# Altium schematic sheet mikroBUS Connection.SchDoc
size A3; Company Name: Renesas Electronics America; CompanyURL: www.renesas.com; PageSetup: Record=PageOptions|CenterHorizontal=True|CenterVertical=True|PrintScale=1.00|XCorrection=1.00|YCorrection=1.00|PrintKind=1|BorderSize=5000000|LeftOffset=0|BottomOffset=0|Orientation=2|PaperLength=1000|PaperWidth=1000|Scale=100|PaperSource=7|PrintQuality=-4|MediaType=1|DitherType=10|PaperKind=A5 148x210mm|PrintScaleMode=1; ReleaseDate: 16.09.2025; Version: MP; SheetNumber: 6; SheetTotal: 18; VariantNumber: 0; DSheetNumber: 1
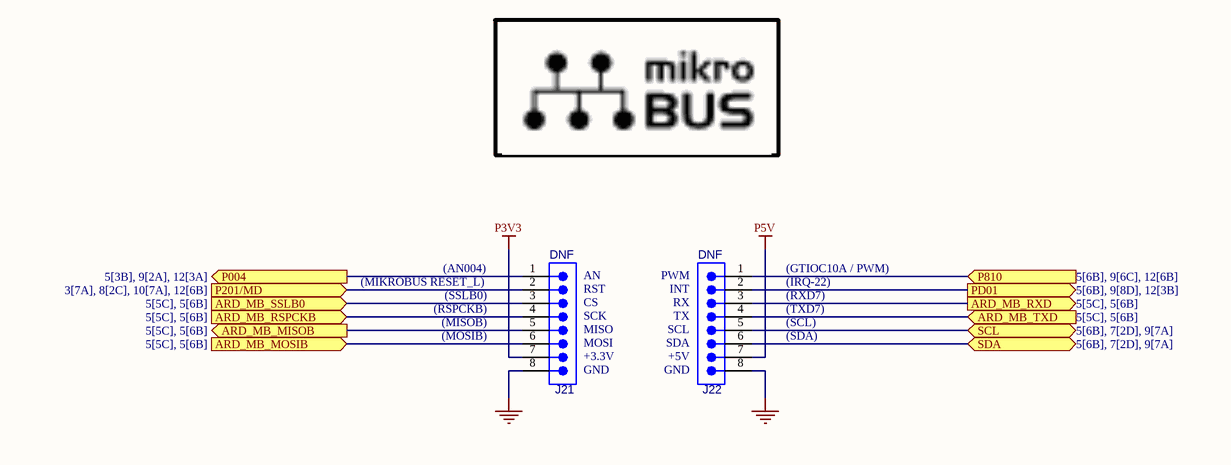
[diagram p0: mikroBUS Connection.SchDoc]

## Parts
J21  CES-108-01-T-S  [sam_CES-108-01-T-S]  (value not drawn)
J22  CES-108-01-T-S  [sam_CES-108-01-T-S]  (value not drawn)
X?  Icon-mikroBUS  [ICON-MIKROBUS]  (value not drawn)  (graphical)

## Ports
ARD_MB_MISOB (out, see 5[5C], 5[6B]), ARD_MB_MOSIB (in, see 5[5C], 5[6B]), ARD_MB_RSPCKB (in, see 5[5C], 5[6B]), ARD_MB_RXD (out, see 5[5C], 5[6B]), ARD_MB_SSLB0 (in, see 5[5C], 5[6B]), ARD_MB_TXD (in, see 5[5C], 5[6B]), P004 (out, see 5[3B], 9[2A], 12[3A]), P201/MD (in, see 3[7A], 8[2C], 10[7A], 12[6B]), P810 (in, see 5[6B], 9[6C], 12[6B]), PD01 (out, see 5[6B], 9[8D], 12[3B]), SCL (bidir, see 5[6B], 7[2D], 9[7A]), SDA (bidir, see 5[6B], 7[2D], 9[7A])

## Nets
GND: J21.8 J22.8
P3V3: J21.7
P5V: J22.7
ARD_MB_MISOB: J21.5 ; port ARD_MB_MISOB
ARD_MB_MOSIB: J21.6 ; port ARD_MB_MOSIB
ARD_MB_RSPCKB: J21.4 ; port ARD_MB_RSPCKB
ARD_MB_RXD: J22.3 ; port ARD_MB_RXD
ARD_MB_SSLB0: J21.3 ; port ARD_MB_SSLB0
ARD_MB_TXD: J22.4 ; port ARD_MB_TXD
P004: J21.1 ; port P004
P201/MD: J21.2 ; port P201/MD
P810: J22.1 ; port P810
PD01: J22.2 ; port PD01
SCL: J22.5 ; port SCL
SDA: J22.6 ; port SDA

## Notes on the sheet
- (MIKROBUS RESET_L)
- (AN004)
- (near J21) AN
- (near J21) RST
- (near J22) PWM
- (near J22) INT
- (IRQ-22)
- (GTIOC10A / PWM)
- (RSPCKB)
- (MOSIB)
- (MISOB)
- (SSLB0)
- (near J21) MOSI
- (near J21) MISO
- (near J21) CS
- (near J21) SCK
- (near J22) SDA
- (near J22) SCL
- (near J22) RX
- (near J22) TX
- (SCL)
- (SDA)
- (RXD7)
- (TXD7)
- (near J21) GND
- (near J21) +3.3V
- (near J22) GND
- (near J22) +5V
- www.renesas.com <http://www.renesas.com>
- Sheet:
- Title:
- Document Number:
- Version:
- Variant:
- Renesas Electronics
- Size:
- A3
- Date:
- Time:
- Page:
- of
- Product Issue:

## Library data of the parts
J21 J22 = CON-00000111-3: Socket,8way,1row,vertical,2.54mm,THT; Operating Voltage Max: 400V; Current: 5.5A; Gender: female; DC Resistance: 10m; Operating Temperature Min: -55°C; Height: 8.35mm; Qualification: -; Operating Temperature Max: 105°C; Pin Count: 8; DNF: DNF
X? = ICON-000001-01: mikroBUS footprint silkscreen